# Altium schematic sheet BME280.SchDoc
size A4; SheetNumber: 11; SheetTotal: 13
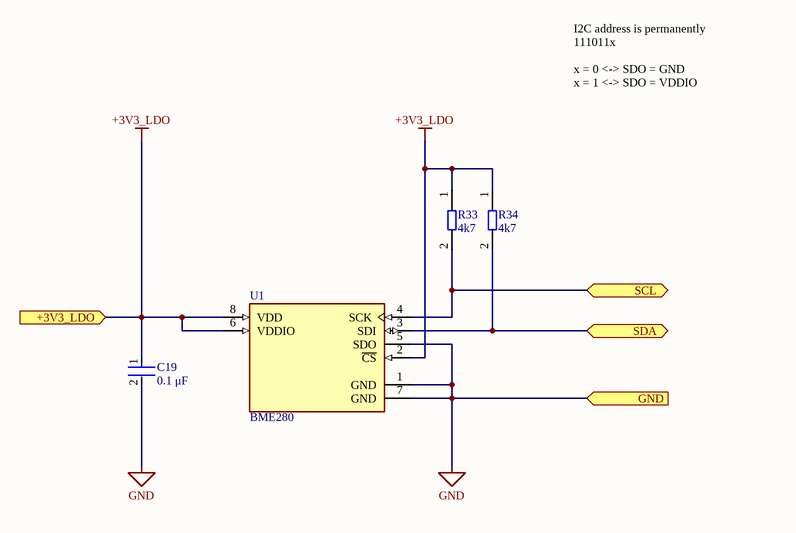
[diagram p0: BME280.SchDoc]

## Parts
C19  0.1 μF  [FP-C0805C-DN-MFG]
R33  4k7  [0805 Resistor - IPC A]
R34  4k7  [0805 Resistor - IPC A]
U1  BME280  [FP-BME280-MFG]

## Ports
+3V3_LDO (in, see Callisto Control Board[7D], 3V3 LDO[3B], Driver Board[1B], INA219_CH1[1A], INA219_CH2[1B], INA219_CH3[1B], INA219_CH4[1B], INA219_CH5[1B], INA219_CH6[1B]), GND (in, see Callisto Control Board[7D], 3V3 LDO[3B], Driver Board[1B], INA219_CH1[1A], INA219_CH2[1B], INA219_CH3[1B], INA219_CH4[1B], INA219_CH5[1B], INA219_CH6[1B], Raspberry Pi[1C]), SCL (bidir, see Callisto Control Board[7D], INA219_CH1[1C], INA219_CH2[1C], INA219_CH3[1C], INA219_CH4[1C], INA219_CH5[1C], INA219_CH6[1C], Raspberry Pi[1B]), SDA (bidir, see Callisto Control Board[7D], INA219_CH1[1C], INA219_CH2[1C], INA219_CH3[1C], INA219_CH4[1C], INA219_CH5[1C], INA219_CH6[1C], Raspberry Pi[1A])

## Nets
+3V3_LDO: C19.1 R33.1 R34.1 U1.2(~{CS}) U1.6(VDDIO) U1.8(VDD) ; port +3V3_LDO
GND: C19.2 U1.1(GND) U1.5(SDO) U1.7(GND) ; port GND
SCL: R33.2 U1.4(SCK) ; port SCL
SDA: R34.2 U1.3(SDI) ; port SDA

## Notes on the sheet
- I2C address is permanently
  111011x
  x = 0 <-> SDO = GND
  x = 1 <-> SDO = VDDIO

## Library data of the parts
C19 = CMP-03020-002581-2: C0805 0.10 μF X7R 30ppm/°C 20.00% 50 V C0805C104M5RAC; Manufacturer: KEMET; Voltage Rating: 50 V; Tolerance: 0.2; Material: Ceramic; Category: Cap; Temperature: -55°C to +125°C; Lead Free: Yes; Device Class L3: Ceramic Capacitors; Package: C0805C-DN; Capacitance: 0.1 μF; Height: 0.88mm; Temperature Range High: +125°C; Device Class L2: Capacitors; Manufacturer Part Number: C0805C104M5RAC; Device Class L1: Passive Components; Temperature Coefficient: 30ppm/°C; ComponentLink2Description: Datasheet; RoHS: TRUE; Temperature Range Low: -55°C; Value: 0.1 μF; ComponentLink2URL: https://content.kemet.com/datasheets/KEM_C1003_C0G_SMD.pdf; Temperature Characteristic: X7R; Mouser Description: Multilayer Ceramic Capacitors MLCC - SMD/SMT 50volts 0.1uF 20% X7R; Octopart: https://octopart.com/c0805c104m5rac-kemet-2226142; Ipc Land Pattern Name: CAPC200125X78; Automotive: No
R33 R34 = RC0805FR-104K7L: Thick Film Resistors - SMD 4.7 kOhms 250 mW 0805 1% / RC0805FR-104K7L; Value: 4k7
U1 = CMP-2000-05073-3: SENSOR PRESSURE HUMIDITY TEMP; Sensor Type: Temperature; Accuracy: 3%; Response Time: 1s; Output Type: SPI; Min Operating Temperature: -40°C; Max Operating Temperature: 85°C; Case/Package: LGA; Packaging: Cut Tape; Mount: Surface Mount; Lead Free: Lead Free; Number of Pins: 8